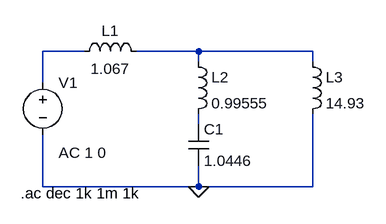
[diagram p0: schematic EJ3.asc]
EJ3.asc, the LTspice schematic file:
Version 4
SHEET 1 880 680
WIRE 32 80 -32 80
WIRE 208 80 112 80
WIRE 384 80 208 80
WIRE 208 96 208 80
WIRE 384 96 384 80
WIRE -32 128 -32 80
WIRE 208 192 208 176
WIRE -32 288 -32 208
WIRE 208 288 208 256
WIRE 208 288 -32 288
WIRE 384 288 384 176
WIRE 384 288 208 288
FLAG 208 288 0
SYMBOL ind 16 96 R270
WINDOW 0 32 56 VTop 2
WINDOW 3 5 56 VBottom 2
SYMATTR InstName L1
SYMATTR Value 1.067
SYMBOL ind 192 80 R0
SYMATTR InstName L2
SYMATTR Value 0.99555
SYMBOL ind 368 80 R0
SYMATTR InstName L3
SYMATTR Value 14.93
SYMBOL cap 192 192 R0
SYMATTR InstName C1
SYMATTR Value 1.0446
SYMBOL voltage -32 112 R0
WINDOW 123 24 124 Left 2
WINDOW 39 0 0 Left 0
SYMATTR InstName V1
SYMATTR Value ""
SYMATTR Value2 AC 1 0
TEXT -66 298 Left 2 !.ac dec 1k 1m 1k

The netlist it stands for:
* EJ3.asc
L1 N001 N002 1.067
L2 N002 N003 0.99555
L3 N002 0 14.93
C1 N003 0 1.0446
V1 N001 0 AC 1 0
.ac dec 1k 1m 1k
.backanno
.end